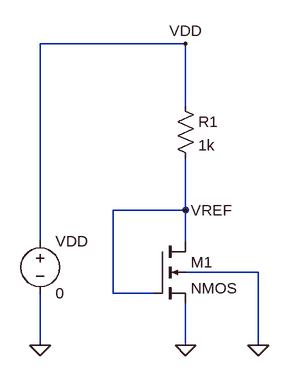
[diagram p0: schematic Chapter03E_01.fig.asc]
Chapter03E_01.fig.asc, the LTspice schematic file:
Version 4
SHEET 1 2940 740
WIRE 32 -336 -192 -336
WIRE 32 -240 32 -336
WIRE 32 -80 32 -160
WIRE 32 -80 -80 -80
WIRE -192 -32 -192 -336
WIRE 32 -32 32 -80
WIRE 144 16 32 16
WIRE -80 48 -80 -80
WIRE -16 48 -80 48
WIRE -192 128 -192 48
WIRE 32 128 32 64
WIRE 144 128 144 16
FLAG -192 128 0
FLAG 32 128 0
FLAG 144 128 0
FLAG 32 -80 VREF
FLAG 32 -336 VDD
SYMBOL voltage -192 -48 R0
WINDOW 123 0 0 Left 0
WINDOW 39 0 0 Left 0
SYMATTR InstName VDD
SYMATTR Value 0
SYMBOL nmos4 -16 -32 R0
SYMATTR InstName M1
SYMBOL res 16 -256 R0
SYMATTR InstName R1
SYMATTR Value 1k

The netlist it stands for:
* Chapter03E_01.fig.asc
VDD VDD 0 0
M1 VREF VREF 0 0 NMOS
R1 VDD VREF 1k
.model NMOS NMOS
.model PMOS PMOS
.lib standard.mos
.backanno
.end